# Altium schematic sheet Eth_DP83848.SchDoc
size A4
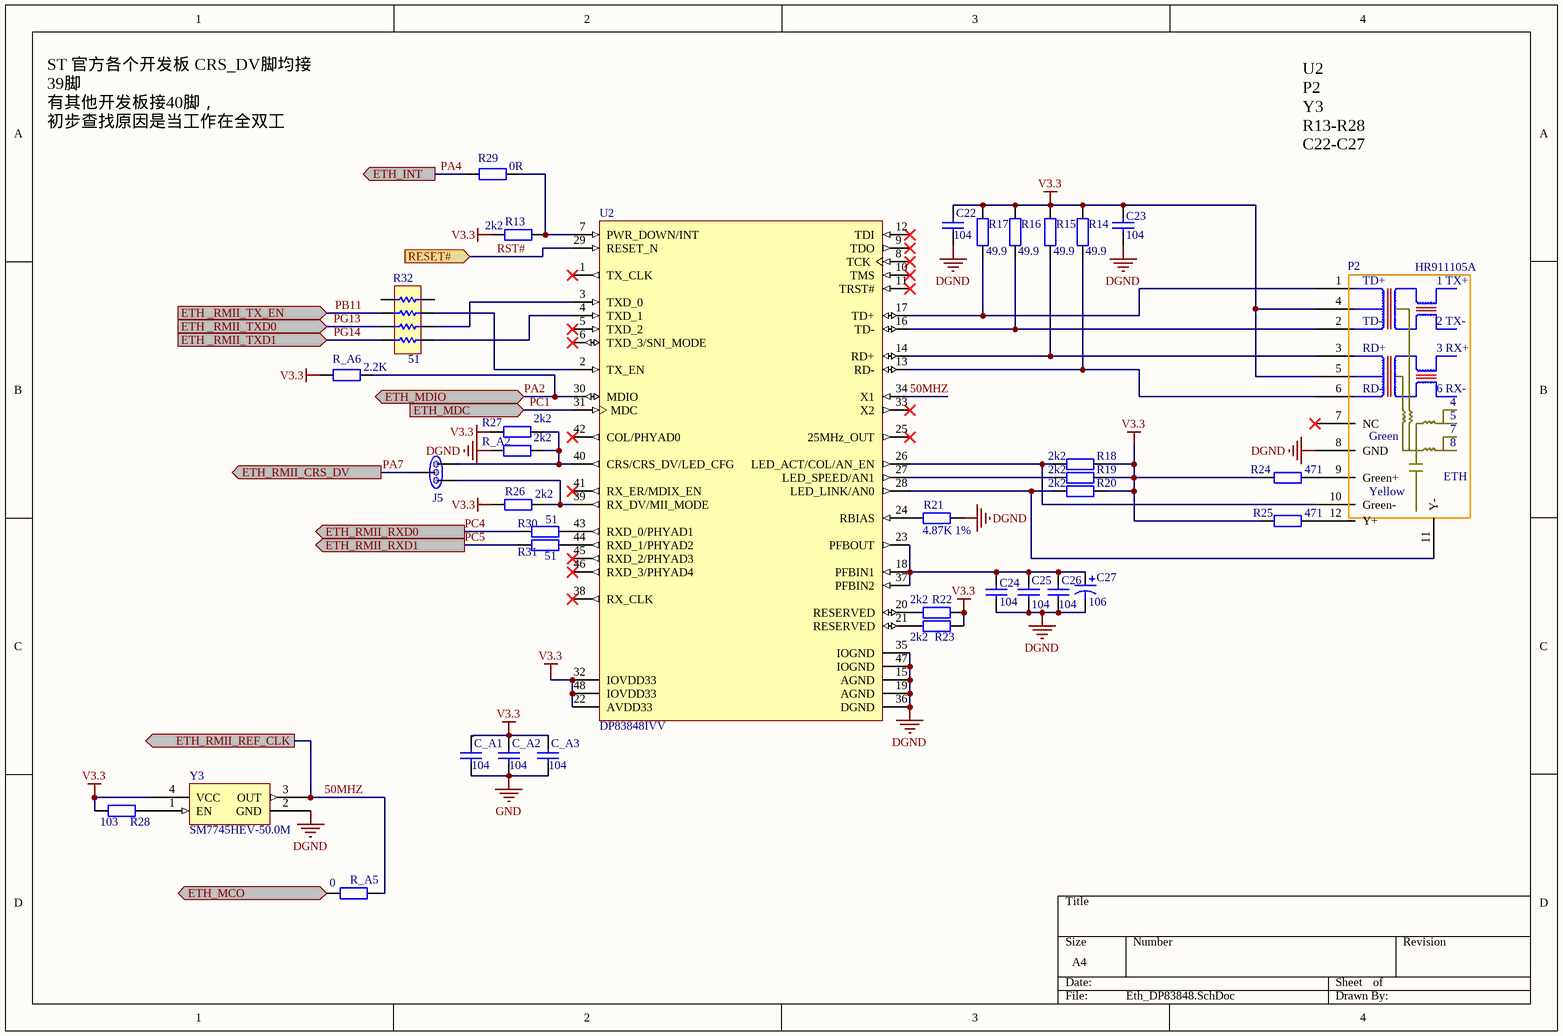
[diagram p0: Eth_DP83848.SchDoc]

## Parts
C22  value 104  [RESC1608L]  (hidden comment: Cap)
C23  value 104  [RESC1608L]  (hidden comment: Cap)
C24  value 104  [RESC1608L]  (hidden comment: Cap)
C25  value 104  [RESC1608L]  (hidden comment: Cap)
C26  value 104  [RESC1608L]  (hidden comment: Cap)
C27  value 106  [C3216A]  (hidden comment: Cap Pol1)
C_A1  value 104  [RESC1608L]  (hidden comment: Cap)
C_A2  value 104  [RESC1608L]  (hidden comment: Cap)
C_A3  value 104  [RESC1608L]  (hidden comment: Cap)
J5  3P  [SEC-3PIN-0805]  (value not drawn)
P2  HR911105A  [HR911105A]
R13  value 2k2  [RESC1608L]  (hidden comment: Res2)
R14  value 49.9  [RESC1608L]  (hidden comment: Res2)
R15  value 49.9  [RESC1608L]  (hidden comment: Res2)
R16  value 49.9  [RESC1608L]  (hidden comment: Res2)
R17  value 49.9  [RESC1608L]  (hidden comment: Res2)
R18  value 2k2  [RESC1608L]  (hidden comment: Res2)
R19  value 2k2  [RESC1608L]  (hidden comment: Res2)
R20  value 2k2  [RESC1608L]  (hidden comment: Res2)
R21  value 4.87K 1%  [RESC1608L]  (hidden comment: Res2)
R22  value 2k2  [RESC1608L]  (hidden comment: Res2)
R23  value 2k2  [RESC1608L]  (hidden comment: Res2)
R24  value 471  [RESC1608L]  (hidden comment: Res2)
R25  value 471  [RESC1608L]  (hidden comment: Res2)
R26  value 2k2  [RESC1608L]  (hidden comment: Res2)
R27  value 2k2  [RESC1608L]  (hidden comment: Res2)
R28  value 103  [RESC1608L]  (hidden comment: Res2)
R29  value 0R  [RESC1608L]  (hidden comment: Res2)
R30  value 51  [RESC1608L]  (hidden comment: Res2)
R31  value 51  [RESC1608L]  (hidden comment: Res2)
R32  value 51  [8P4R_0603]  (hidden comment: 0603-4R)
R_A2  value 2k2  [RESC1608L]  (hidden comment: Res2)
R_A5  value 0  [RESC1608L]  (hidden comment: Res2)
R_A6  value 2.2K  [RESC1608L]  (hidden comment: Res2)
U2  DP83848IVV  [VBH48A_N]
Y3  SM7745HEV-50.0M  [XTAL_5X7]

## Ports
ETH _RMII_TX_EN (in), ETH _RMII_TXD0 (in), ETH _RMII_TXD1 (in), ETH_INT (out), ETH_MCO (in), ETH_MDC (in), ETH_MDIO (bidir), ETH_RMII_CRS_DV (out), ETH_RMII_REF_CLK (out), ETH_RMII_RXD0 (out), ETH_RMII_RXD1 (out), RESET# (in)

## Nets
DGND: C22.1 C23.1 C24.1 C25.1 C26.1 C27.2 P2.8(GND) R21.2 R_A2.2 U2.15(AGND) U2.19(AGND) U2.35(IOGND) U2.36(DGND) U2.47(IOGND) Y3.2(GND)
GND: C_A1.1 C_A2.1 C_A3.1
V3.3: C22.2 C23.2 C_A2.2 C_A3.2 P2.4 P2.5 R13.1 R14.2 R15.2 R16.2 R17.2 R18.2 R19.2 R20.2 R22.2 R23.2 R24.1 R25.1 R26.1 R27.2 R28.2 R_A6.1 U2.22(AVDD33) U2.32(IOVDD33) U2.48(IOVDD33) Y3.4(VCC)
50MHZ: R_A5.2 U2.34(X1) Y3.3(OUT) ; port ETH_RMII_REF_CLK
ETH_MCO: R_A5.1 ; port ETH_MCO
PA2: R_A6.2 U2.30(MDIO) ; port ETH_MDIO
PA4: R29.1 ; port ETH_INT
PA7: J5.2 ; port ETH_RMII_CRS_DV
PB11: R32.3 ; port ETH _RMII_TX_EN
PC1: U2.31(MDC) ; port ETH_MDC
PC4: R30.1 ; port ETH_RMII_RXD0
PC5: R31.1 ; port ETH_RMII_RXD1
PG13: R32.5 ; port ETH _RMII_TXD0
PG14: R32.7 ; port ETH _RMII_TXD1
RST#: U2.29(RESET_N) ; port RESET#
NetC24_2: C24.2 C25.2 C26.2 C27.1 U2.18(PFBIN1) U2.23(PFBOUT) U2.37(PFBIN2)
NetJ5_1: J5.1 R27.1 R_A2.1 U2.40(CRS/CRS_DV/LED_CFG)
NetJ5_3: J5.3 R26.2 U2.39(RX_DV/MII_MODE)
NetP2_1: P2.1 R17.1 U2.17(TD+)
NetP2_2: P2.2 R16.1 U2.16(TD-)
NetP2_3: P2.3 R15.1 U2.14(RD+)
NetP2_6: P2.6 R14.1 U2.13(RD-)
NetP2_9: P2.9(Green+) R24.2
NetP2_10: P2.10(Green-) R18.1 U2.26(LED_ACT/COL/AN_EN)
NetP2_11: P2.11(Y-) R20.1 U2.28(LED_LINK/AN0)
NetP2_12: P2.12(Y+) R25.2
NetR13_2: R13.2 R29.2 U2.7(PWR_DOWN/INT)
NetR19_1: R19.1 U2.27(LED_SPEED/AN1)
NetR21_1: R21.1 U2.24(RBIAS)
NetR22_1: R22.1 U2.20(RESERVED)
NetR23_1: R23.1 U2.21(RESERVED)
NetR28_1: R28.1 Y3.1(EN)
NetR30_2: R30.2 U2.43(RXD_0/PHYAD1)
NetR31_2: R31.2 U2.44(RXD_1/PHYAD2)
NetR32_4: R32.4 U2.2(TX_EN)
NetR32_6: R32.6 U2.3(TXD_0)
NetR32_8: R32.8 U2.4(TXD_1)

Not connected (* = marked no-connect by the designer): C_A1 2; P2 7(NC)*; R32 1 2; U2 1(TX_CLK)* 5(TXD_2)* 6(TXD_3/SNI_MODE)* 8(TCK)* 9(TDO)* 10(TMS)* 11(TRST#)* 12(TDI)* 25(25MHz_OUT)* 33(X2)* 38(RX_CLK)* 41(RX_ER/MDIX_EN)* 42(COL/PHYAD0)* 45(RXD_2/PHYAD3)* 46(RXD_3/PHYAD4)*

## Notes on the sheet
- U2
  P2
  Y3
  R13-R28
  C22-C27
- ST 官方各个开发板 CRS_DV脚均接39脚
  有其他开发板接40脚，
  初步查找原因是当工作在全双工
- (in symbol HR911105A) TD+; 1 TX+; TD-; 2 TX-; RD+; 3 RX+; RD-; 6 RX-; Green; ETH; Yellow

## Library data of the parts
C22-C26 C_A1-C_A3 = Cap: Capacitor; Published: 8-Jun-2000; LatestRevisionDate: 17-Jul-2002; LatestRevisionNote: Re-released for DXP Platform.; PackageReference: RAD-0.3; Publisher: Altium Limited
C27 = Cap Pol1: Polarized Capacitor (Radial); Published: 8-Jun-2000; LatestRevisionDate: 17-Jul-2002; LatestRevisionNote: Re-released for DXP Platform.; PackageReference: RB7.6-15; Publisher: Altium Limited
R13-R31 R_A2 R_A5 R_A6 = Res2: Resistor; Published: 8-Jun-2000; LatestRevisionDate: 17-Jul-2002; LatestRevisionNote: Re-released for DXP Platform.; PackageReference: AXIAL-0.4; Publisher: Altium Limited
R32 = Resister Array
U2 = DP83848IVV: PHYTER?Industrial Temperature Single Port 10/100 Mb/s Ethernet Physical Layer Transceiver; Manufacturer: National Semiconductor; CompType: Interface IC; PackageTopMarking: NSUZXYTT*DP83848VV*VBI; PowerWise: N; Published: 4-Dec-2008; DatasheetVersion: Feb-2007; PackageVersion: revE, May-2007; PackageReference: VBH48A; Publisher: Altium Limited; PackageDescription: LQFP, 7 x 7 x 1.4mm, 48 Lead, 0.5mm Pitch; PartNumber: DP83848IVV; RoHS: Y; PinCount: 48; DigiKeyPartNumber: DP83848IVV-ND; ComponentLink1Description: DP83848I Datasheet; ComponentLink1URL: http://www.national.com/ds/DP/DP83848I.pdf; ComponentLink2Description: DP83848I Web Page; ComponentLink2URL: http://www.national.com/pf/DP/DP83848I.html; ComponentLink3Description: VBH48A Package Page; ComponentLink3URL: http://www.national.com/packaging/folders/vbh48a.html